# Altium schematic sheet Sheet1.SchDoc
size A3; PageSetup: Record=PageOptions|CenterHorizontal=True|CenterVertical=True|PrintScale=1.00|XCorrection=1.00|YCorrection=1.00|PrintKind=0|BorderSize=5000000|LeftOffset=0|BottomOffset=0|Orientation=2|PaperLength=1000|PaperWidth=1000|Scale=100|PaperSource=7|PrintQuality=-4|MediaType=1|DitherType=10|PaperKind=A4|PrintScaleMode=1
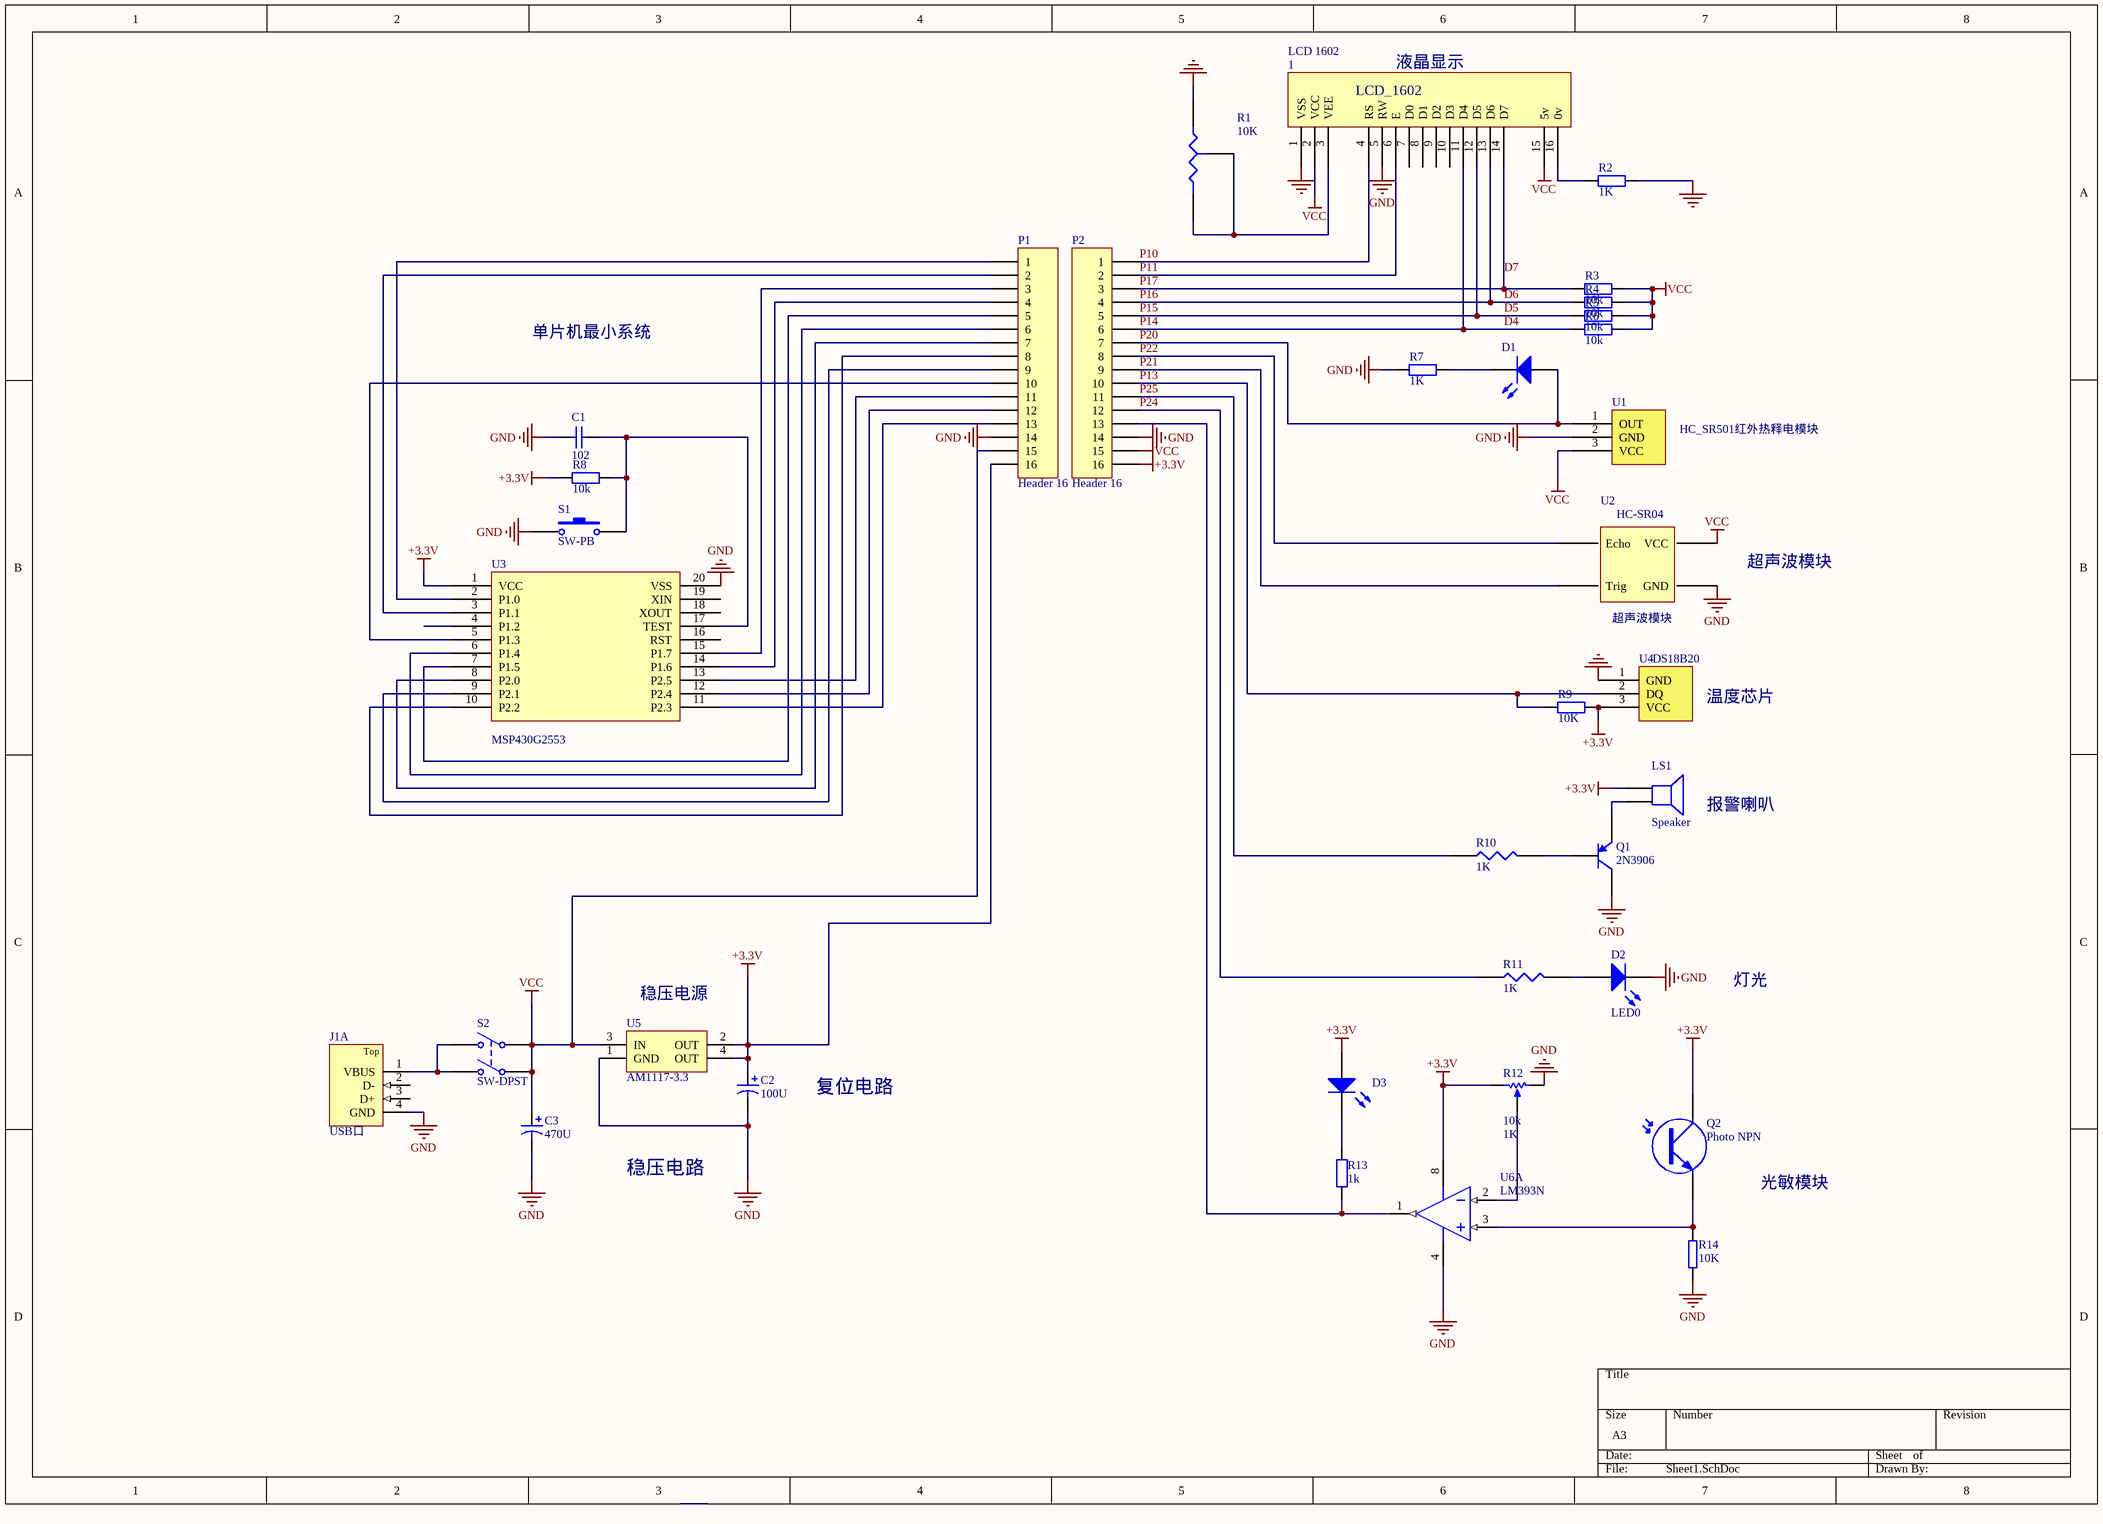
[diagram p0: Sheet1.SchDoc]

## Parts
1  LCD 1602  [1602SW]
C1  102  [VP32-3.2]
C2  100U  [10UF]
C3  470U  [10UF]
D1  (no value)  [led]
D2  LED0  [LED]
D3  (no value)  [LED]
J1  USB口  [440128B]  (part A of 4)
LS1  Speaker  [PIN2]
P1  Header 16  [HDR1X16]
P2  Header 16  [HDR1X16]
Q1  2N3906  [TO-92A]
Q2  Photo NPN  [TO-220_A]
R1  10K  [RB]
R2  1K  [AXIAL-0.4]
R3  10k  [AXIAL-0.4]
R4  10k  [AXIAL-0.4]
R5  10k  [AXIAL-0.4]
R6  10k  [AXIAL-0.4]
R7  1K  [AXIAL-0.4]
R8  10k  [AXIAL-0.4]
R9  10K  [AXIAL-0.4]
R10  1K  [AXIAL-0.4]
R11  1K  [AXIAL-0.4]
R12  10k  value 1K  [VR5]
R13  1k  [AXIAL-0.4]
R14  10K  [AXIAL-0.4]
S1  SW-PB  [PB]
S2  SW-DPST  [POWER_SW]
U1  HC_SR501红外热释电模块  [HDR1X3]
U2  超声波模块
U3  MSP430G2553
U4  DS18B20  [1820]
U5  AM1117-3.3  [ZZ311]
U6  LM393N  [N08E]  (part A of 2)

## Nets
+3.3V: C2.1 D3.1(A) LS1.1 P1.16 P2.16 Q2.1(C) R8.1 R9.2 R12.2(BOT) U3.1(VCC) U4.3(VCC) U5.2(OUT) U5.4(OUT) U6.8(V+)
GND: 1.1(VSS) 1.5(RW) C1.1 C2.2 C3.2 D2.2 J1.4(GND) P1.14 P2.14 Q1.3(C) R1.1(A) R2.1 R7.1 R12.1(TOP) R14.2 S1.1 U1.2(GND) U2.?4(GND) U3.20(VSS) U4.1(GND) U5.1(GND) U6.4(GND)
VCC: 1.2(VCC) 1.15(5v) C3.1 P1.15 P2.15 R3.2 R4.2 R5.2 R6.2 S2.1(COMMON1) S2.3(COMMON2) U1.3(VCC) U2.?3(VCC) U5.3(IN)
D4: 1.11(D4) P2.6 R6.1  [also labelled P14]
D5: 1.12(D5) P2.5 R5.1  [also labelled P15]
D6: 1.13(D6) P2.4 R4.1  [also labelled P16]
D7: 1.14(D7) P2.3 R3.1  [also labelled P17]
P10: 1.4(RS) P2.1
P11: 1.6(E) P2.2
P13: P2.10 R9.1 U4.2(DQ)
P20: D1.1(A) P2.7 U1.1(OUT)
P21: P2.9 U2.?2(Trig)
P22: P2.8 U2.?1(Echo)
P24: P2.12 R11.2
P25: P2.11 R10.2
Net1_3: 1.3(VEE) R1.2(B) R1.3(TAP)
Net1_16: 1.16(0v) R2.2
NetC1_2: C1.2 R8.2 S1.2 U3.17(TEST)
NetD1_2: D1.2(K) R7.2
NetD2_1: D2.1 R11.1
NetD3_2: D3.2(K) R13.2
NetJ1_1: J1.1(VBUS) S2.2(NO1) S2.4(NO2)
NetLS1_2: LS1.2 Q1.1(E)
NetP1_1: P1.1 U3.2(P1.0)
NetP1_2: P1.2 U3.3(P1.1)
NetP1_3: P1.3 U3.15(P1.7)
NetP1_4: P1.4 U3.14(P1.6)
NetP1_5: P1.5 U3.7(P1.5)
NetP1_6: P1.6 U3.6(P1.4)
NetP1_7: P1.7 U3.8(P2.0)
NetP1_8: P1.8 U3.10(P2.2)
NetP1_9: P1.9 U3.9(P2.1)
NetP1_10: P1.10 U3.5(P1.3)
NetP1_11: P1.11 U3.13(P2.5)
NetP1_12: P1.12 U3.12(P2.4)
NetP1_13: P1.13 U3.11(P2.3)
NetP2_13: P2.13 R13.1 U6.1(OUT)
NetQ1_2: Q1.2(B) R10.1
NetQ2_3: Q2.3(E) R14.1 U6.3(IN+)
NetR12_3: R12.3(TAP) U6.2(IN-)

Not connected (* = marked no-connect by the designer): 1 7(D0) 8(D1) 9(D2) 10(D3); J1 2(D-) 3(D+); U3 4(P1.2) 16(RST) 18(XOUT) 19(XIN)

## Notes on the sheet
- 液晶显示
- 单片机最小系统
- 超声波模块
- 温度芯片
- 报警喇叭
- 灯光
- (near U5) 稳压电源
- 复位电路
- 稳压电路
- 光敏模块
- (in symbol 1-440128-0, part A) Top
- (in symbol LCD) LCD_1602
- (in symbol 超声波模块) HC-SR04

## Library data of the parts
1 = LCD
C1 = Cap: Capacitor; Value: 100pF; Published: 8-Jun-2000; LatestRevisionDate: 17-Jul-2002; LatestRevisionNote: Re-released for DXP Platform.; PackageReference: RAD-0.3; Publisher: Altium Limited
C2 C3 = Cap Pol1: Polarized Capacitor (Radial); Published: 8-Jun-2000; LatestRevisionDate: 17-Jul-2002; LatestRevisionNote: Re-released for DXP Platform.; PackageReference: RB7.6-15; Publisher: Altium Limited
D1-D3 = LED0: Typical INFRARED GaAs LED; Published: 8-Jun-2000; LatestRevisionDate: 08-Jul-2005; LatestRevisionNote: Mech Layer 1 removed.; PackageReference: LED-0; Publisher: Altium Limited
J1 = 1-440128-0: USB 1.1, Right Angle, Thru-Hole, A Type, Receptacle, 4x4x4 Position, Triple Stacked, Black; ContactMaterial: Copper Alloy; ContactPlating: Gold (5) over Nickel; TerminationLength: 2.84mm [0.112in.]; PCB_Layout: Complies with manufacturer's recommendation.; DrillSize: Corresponds to nominal value.; PanelGround: Without; Published: 15-Jul-2004; DatasheetDocument: 21-Sep-2001; PackageDocument: 21-Sep-2001; PackageReference: 440128B; Publisher: Altium Limited; HousingMaterial: Thermoplastic; ComponentLink1Description: Manufacturer Link; ComponentLink1URL: http://www.tycoelectronics.com/; ComponentLink2Description: Packaging Specification; ComponentLink2URL: http://ecommas.tycoelectronics.com/commerce/DocumentDelivery/DDEController?Action=showdoc&DocId=Customer+Drawing%7F440128%7FA%7Ftif%7FEnglish%7FC_440128_A.tif
LS1 = Speaker: Loudspeaker; Published: 24-Mar-1999; LatestRevisionDate: 17-Jul-2002; LatestRevisionNote: Re-released for DXP Platform.; PackageReference: PIN2; Publisher: Altium Limited
P1 P2 = Header 16: Header, 16-Pin; LatestRevisionDate: 17-Jul-2002; LatestRevisionNote: Re-released for DXP Platform.; Publisher: Altium Limited
Q1 = 2N3906: PNP General Purpose Amplifier; Published: 8-Jun-2000; LatestRevisionDate: 15-Jan-2003; LatestRevisionNote: PCB Footprint 'BCY-W3/D4.7' replaced; DatasheetDocument: 1997; PackageDocument: Sep-1998; PackageReference: TO-92A; Publisher: Altium Limited; Code_JEDEC: TO-92A; ComponentLink1Description: Manufacturer Link; ComponentLink1URL: http://www.fairchildsemi.com/; ComponentLink2Description: Datasheet; ComponentLink2URL: http://www.fairchildsemi.com/ds/2N%2F2N3906.pdf
Q2 = Photo NPN: NPN Phototransistor; Published: 24-Mar-1999; LatestRevisionDate: 17-Jul-2002; LatestRevisionNote: Re-released for DXP Platform.; PackageReference: TO-220_A; Publisher: Altium Limited; Code_JEDEC: TO-220-AC
R1 = Res Tap: Tapped Resistor; Sim Note: Enter the Resistance value and the set point into parameter fields.; Set Position: 0.5; Published: 24-Mar-1999; LatestRevisionDate: 17-Jul-2002; LatestRevisionNote: Re-released for DXP Platform.; PackageReference: VR3; Publisher: Altium Limited
R2-R8 R13 = Res2: Resistor; Published: 8-Jun-2000; LatestRevisionDate: 17-Jul-2002; LatestRevisionNote: Re-released for DXP Platform.; PackageReference: AXIAL-0.4; Publisher: Altium Limited
  R7 R13: Value: 1K
R9 = Res2: Resistor; Value: 1K; Published: 8-Jun-2000; LatestRevisionDate: 17-Jul-2002; LatestRevisionNote: Re-released for DXP Platform.; PackageReference: AXIAL-0.4; Publisher: Altium Limited
R10 R11 = RES1
R12 = RPot: Potentiometer; Sim Note: Enter the Resistance value and the set point into parameter fields.; Set Position: 0.5; Published: 8-Jun-2000; LatestRevisionDate: 17-Jul-2002; LatestRevisionNote: Re-released for DXP Platform.; PackageReference: VR5; Publisher: Altium Limited
R14 = RES
S1 = SW-PB: Switch; Published: 24-Mar-1999; LatestRevisionDate: 17-Jul-2002; LatestRevisionNote: Re-released for DXP Platform.; PackageReference: SPST-2; Publisher: Altium Limited
S2 = SW-DPST: Double-Pole, Single-Throw Switch; Published: 24-Mar-1999; LatestRevisionDate: 17-Jul-2002; LatestRevisionNote: Re-released for DXP Platform.; PackageReference: DPST-4; Publisher: Altium Limited
U1 = IR38
U5 = REG1117-3.3: 800mA and 1A Low Dropout Positive Regulator 2.85V, 3.3V, 5V, and Adjustable; Published: 8-Jun-2000; LatestRevisionDate: 17-Jul-2002; LatestRevisionNote: Re-released for DXP Platform.; DatasheetVersion: Sep-1997; PackageVersion: revC; PackageReference: ZZ311; Publisher: Altium Limited; PackageDescription: SOT-223/SC-73; 4 Leads; Body 6.7 x 7.3 mm, inc. leads (LxW max); ComponentLink1Description: Manufacturer Link; ComponentLink1URL: http://www.ti.com/; ComponentLink2Description: Datasheet; ComponentLink2URL: http://www-s.ti.com/sc/ds/REG1117.pdf
U6 = LM393N: Low-Power Low Offset Voltage Dual Comparator; Published: 15-Apr-2002; LatestRevisionDate: 06-Jun-2005; LatestRevisionNote: Stylized 3D Model Added.; DatasheetVersion: Oct-1999; PackageVersion: Sep-1997; PackageReference: N08E; Publisher: Altium Limited; PackageDescription: DIP; 8 Leads; Row Spacing 7.62 mm; Pitch 2.54 mm; ComponentLink1Description: Manufacturer Link; ComponentLink1URL: http://www.national.com/; ComponentLink2Description: Datasheet; ComponentLink2URL: http://www.national.com/ds.cgi/LM/LM193.pdf; ComponentLink3Description: URL Link1; ComponentLink3URL: http://www.national.com/pf/LM/LM393.html